# EasyEDA Pro project ACS DIN Controller.eprj, board Top Board
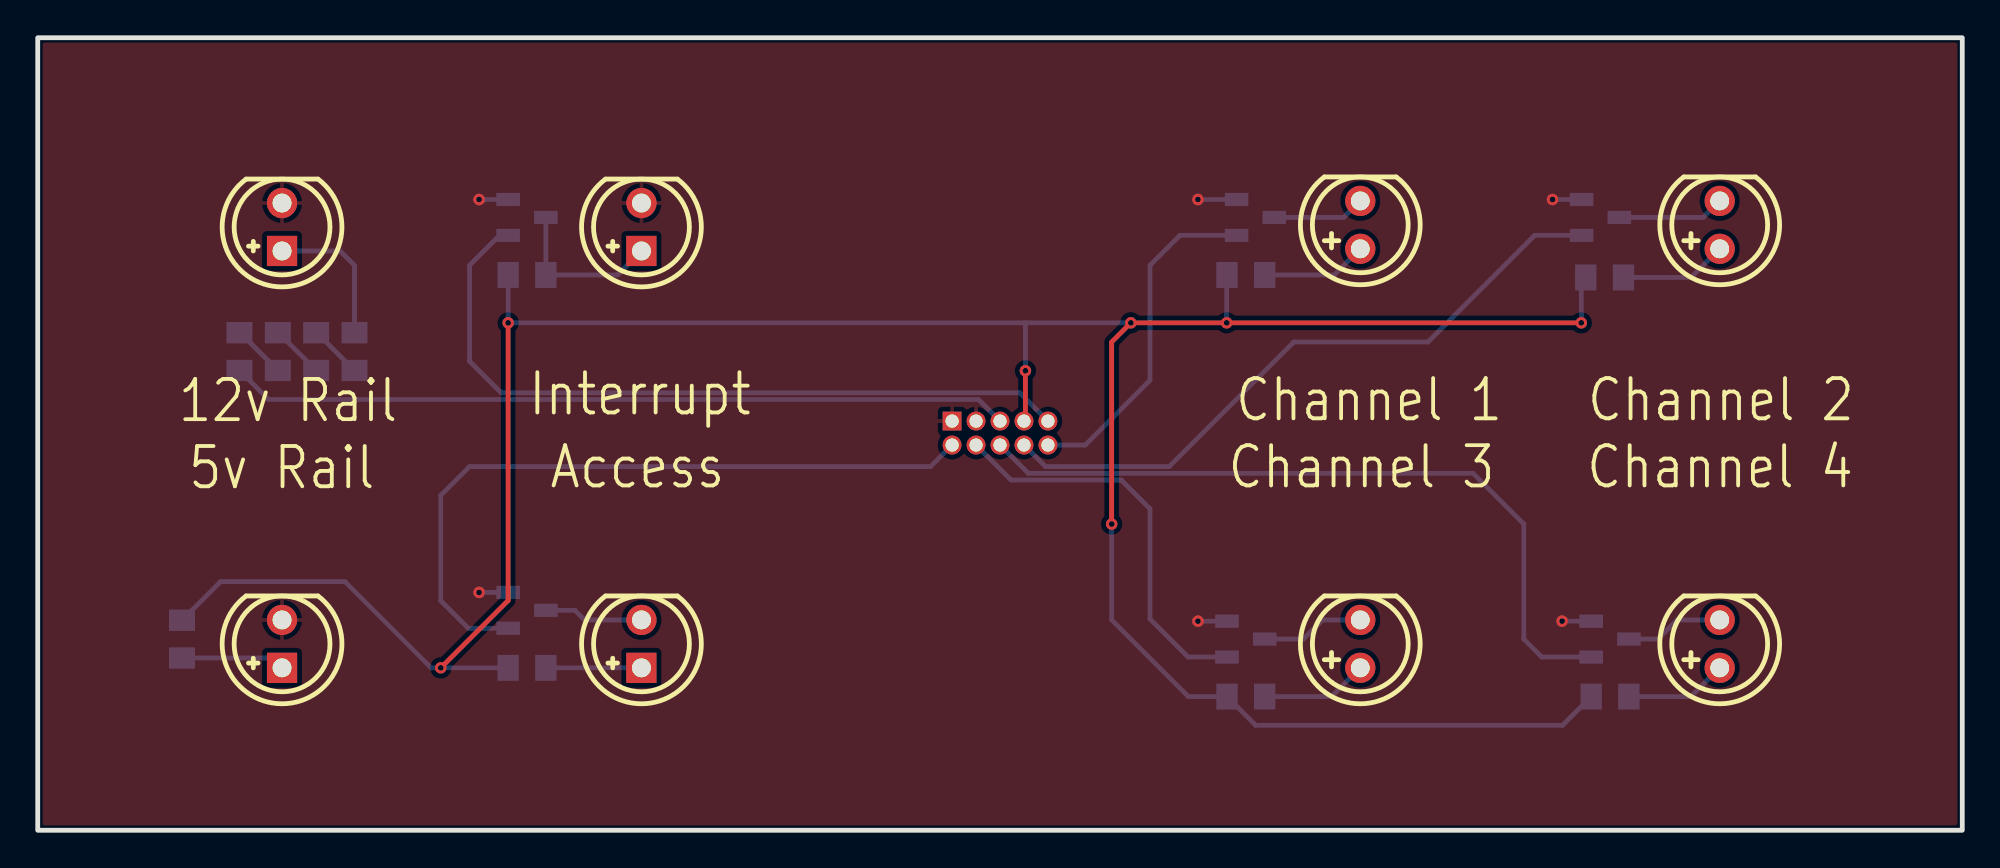
[diagram p4: board, top side]
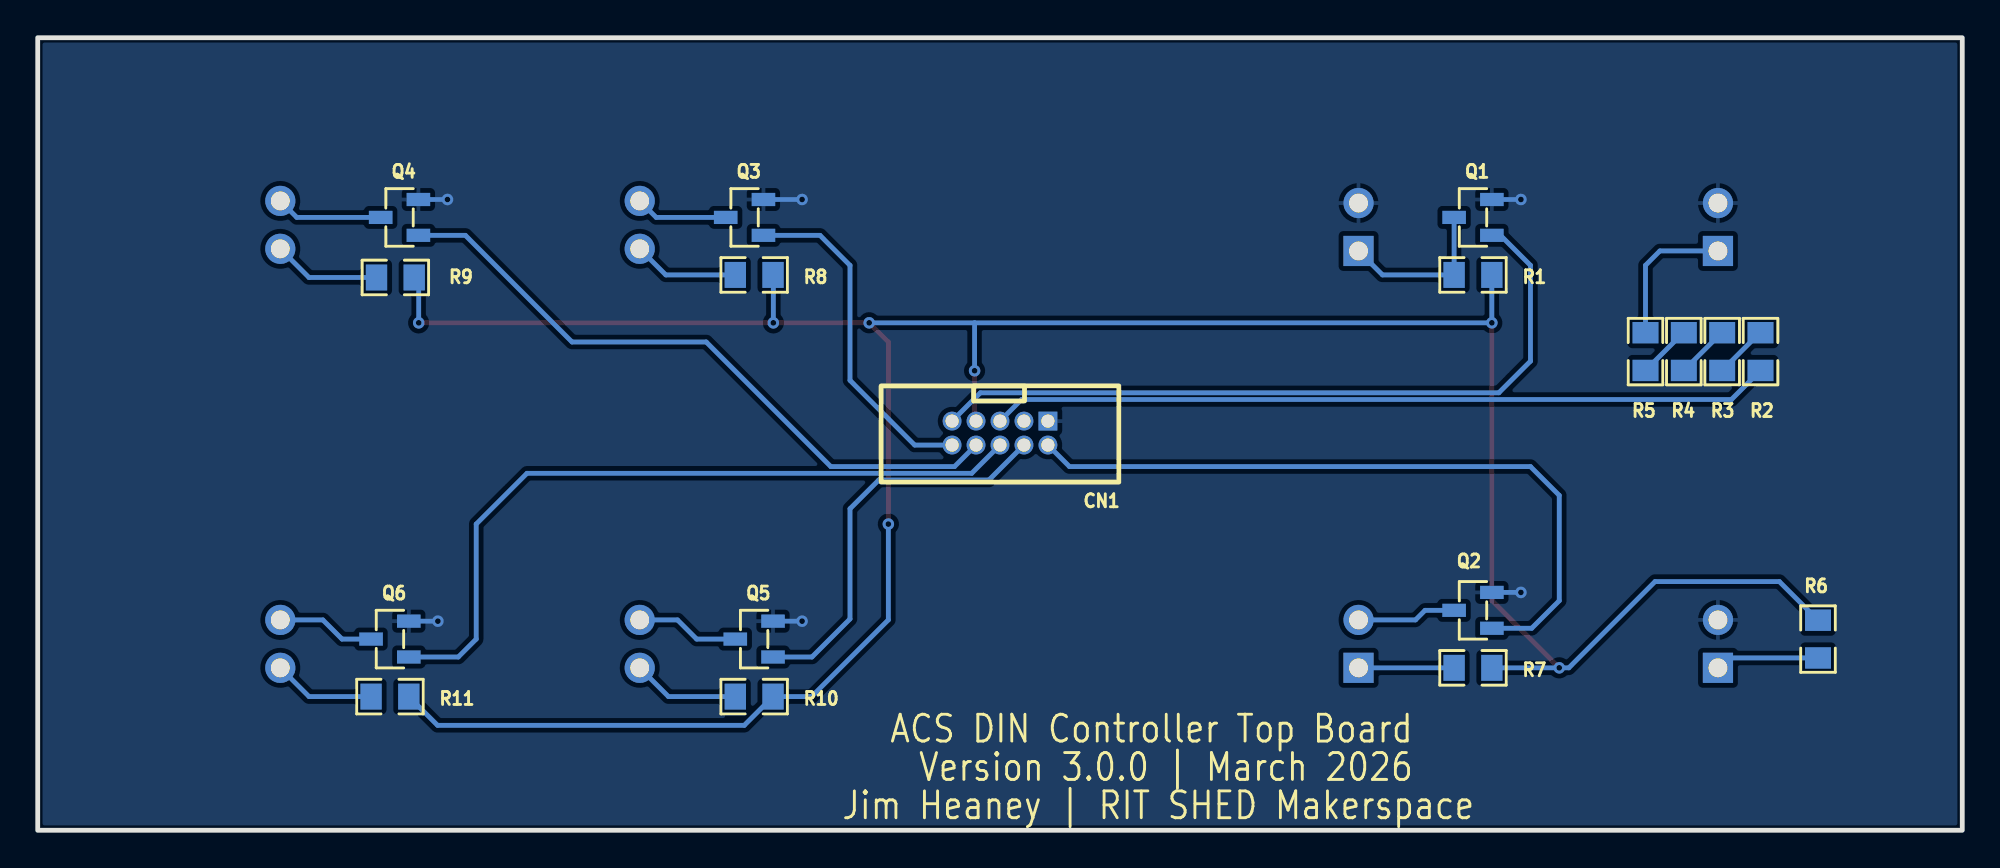
[diagram p5: board, bottom side, seen from below]

Outline 102.01 x 42.01 mm; copper layers: Top Layer, Bottom Layer. Coordinates in mm from the lower left corner of the outline.
Outline path: rectangle 0,0 102.01,42.01
Stack: Top Layer 0.035mm / Dielectric1 1.51mm FR4 er 4.5 / Bottom Layer 0.035mm

## Design rules (mm)
template: JLCPCB Capability(Two Layers Board)
spacing copperThickness1oz (default): track to track 0.102, other pairs 0.152 to 0.3
spacing copperThickness2oz: track to track 0.203, other pairs 0.152 to 0.3
track width copperThickness1oz (default): min 0.127, default 0.254, max 2.54
track width copperThickness2oz: min 0.203, default 0.254, max 2.54
differential pair differentialPair (default): width min 0.127, default 0.254, max 2.54; gap min 0.152, default 0.152
via viaSize (default): diameter min 0.5, default 0.61, max 10; hole min 0.3, default 0.305, max 6.3

## Placement (name value [footprint] x y rotation side)
CN1  X1270WV-2x05B-9TV01  [IDC-TH_10P-P1.27-X1270WV-2X05A-6TV01]  51 21.06 0 bottom
LED1  TJ-L5FYTGCRTFCSFLC2R-A5  [LED-TH_BD5.8-P2.54-FD]  32 31.98 90 top
LED2  TJ-L5FYTYGTDLSFLC6TW-A5  [LED-TH_BD5.8-P2.54-FD]  12.95 31.98 90 top
LED3  TJ-L5FYTYGTDLSFLC6TW-A5  [LED-TH_BD5.8-P2.54-FD]  12.95 9.88 90 top
LED4  TJ-L5FYTGHTCGSFLC9Y-A5  [LED-TH_BD5.8-P2.54-FD]  32 9.88 90 top
LED5  TJ-L5FYTGCTCGLFLC2G-A5  [LED-TH_BD5.0-P2.54-FD]  70.1 32.09 90 top
LED6  TJ-L5FYTGCTCGLFLC2G-A5  [LED-TH_BD5.0-P2.54-FD]  89.15 32.09 90 top
LED7  TJ-L5FYTGCTCGLFLC2G-A5  [LED-TH_BD5.0-P2.54-FD]  70.1 9.88 90 top
LED8  TJ-L5FYTGCTCGLFLC2G-A5  [LED-TH_BD5.0-P2.54-FD]  89.15 9.88 90 top
Q1  HL3400A  [SOT-23-3_L2.9-W1.3-P1.90-LS2.4-BR]  25.93 32.49 180 bottom
Q2  HL3400A  [SOT-23-3_L2.9-W1.3-P1.90-LS2.4-BR]  25.93 11.66 180 bottom
Q3  HL3400A  [SOT-23-3_L2.9-W1.3-P1.90-LS2.4-BR]  64.54 32.49 180 bottom
Q4  HL3400A  [SOT-23-3_L2.9-W1.3-P1.90-LS2.4-BR]  82.83 32.49 180 bottom
Q5  HL3400A  [SOT-23-3_L2.9-W1.3-P1.90-LS2.4-BR]  64.03 10.13 180 bottom
Q6  HL3400A  [SOT-23-3_L2.9-W1.3-P1.90-LS2.4-BR]  83.34 10.13 180 bottom
R1  1kΩ  [R0805]  25.93 29.44 180 bottom
R2  1kΩ  [R0805]  10.69 25.37 270 bottom
R3  1kΩ  [R0805]  12.73 25.37 270 bottom
R4  1kΩ  [R0805]  14.76 25.37 270 bottom
R5  1kΩ  [R0805]  16.79 25.37 270 bottom
R6  1kΩ  [R0805]  7.65 10.13 90 bottom
R7  1kΩ  [R0805]  25.93 8.61 180 bottom
R8  1kΩ  [R0805]  64.03 29.44 180 bottom
R9  1kΩ  [R0805]  83.05 29.3 180 bottom
R10  1kΩ  [R0805]  64.03 7.09 180 bottom
R11  1kΩ  [R0805]  83.34 7.09 180 bottom

## Footprints (pads in the part's own frame, mm; a bottom-side part is the same pattern mirrored in y, then rotated)
IDC-TH_10P-P1.27-X1270WV-2X05A-6TV01
  rect 1x1 hole 0.7: 1(-2.54,-0.635)
  round 1 hole 0.7: 2(-2.54,0.635) 3(-1.27,-0.635) 4(-1.27,0.635) 5(0,-0.635) 6(0,0.635) 7(1.27,-0.635) 8(1.27,0.635) 9(2.54,-0.635) 10(2.54,0.635)
LED-TH_BD5.0-P2.54-FD
  round 1.6 hole 1: 1(-1.27,0) 2(1.27,0)
LED-TH_BD5.8-P2.54-FD
  rect 1.6x1.6 hole 1: 1(-1.27,0)
  round 1.6 hole 1: 2(1.27,0)
R0805
  rect 1.133x1.377 smd: 1(-1,0) 2(1,0)
SOT-23-3_L2.9-W1.3-P1.90-LS2.4-BR
  rect 1.25x0.7 smd: 1(1,-0.95) 2(1,0.95) 3(-1,0)

## Nets
As in the schematic.

## Via types
v1: diameter 0.61, hole 0.305, Top Layer to Bottom Layer, 13 vias

## Routing (per net, layer and track width the routed paths; a pad name or vN(x,y) marks a point on that pad's centre or on a via; arc(x,y) is an arc through that point)
+5V: length 154
  Top Layer w0.254: CN1.7 52.35,21.77 v1(52.35,24.36) ; v1(81.81,26.9) v1(63.02,26.9) v1(57.94,26.9) 56.92,25.88 v1(56.92,16.23) ; v1(21.36,8.61) 24.93,12.18 v1(24.93,26.9)
  Bottom Layer w0.254: R9.2 81.81,29.07 v1(81.81,26.9) ; R7.2 v1(21.36,8.61) 20.85,8.61 16.28,13.18 9.69,13.18 R6.2 ; v1(56.92,16.23) 56.92,11.15 60.99,7.09 R10.2 64.56,5.56 80.81,5.56 R11.2 ; 52.35,26.9 v1(57.94,26.9) ; 52.35,26.9 v1(24.93,26.9) R1.2 ; 52.35,26.9 v1(52.35,24.36) ; v1(63.02,26.9) 63.02,29.42 R8.2
+12V: length 41.4
  Bottom Layer w0.254: CN1.5 49.86,22.83 12.23,22.83 R2.2
GND: length 9.7
  Bottom Layer w0.254: Q6.2 v1(80.8,11.08) ; Q5.2 v1(61.49,11.08) ; Q2.2 v1(23.39,12.61) ; Q3.2 v1(61.49,33.44) ; Q4.2 v1(80.29,33.44) ; Q1.2 v1(23.39,33.44)
ACCESS: length 38
  Bottom Layer w0.254: Q2.1 22.82,10.71 21.36,12.17 21.36,17.75 22.89,19.28 47.32,19.28 CN1.2
GPIO1: length 18.2
  Bottom Layer w0.254: Q3.1 60.54,31.54 58.95,29.95 58.95,23.85 55.52,20.42 CN1.10
GPIO2: length 35.1
  Bottom Layer w0.254: CN1.8 53.42,19.28 59.97,19.28 66.57,25.88 73.69,25.88 79.34,31.54 Q4.1
GPIO3: length 21.4
  Bottom Layer w0.254: CN1.4 51.59,18.57 57.43,18.57 58.95,17.04 58.95,11.2 60.97,9.18 Q5.1
GPIO4: length 39.6
  Bottom Layer w0.254: CN1.6 52.5,18.92 76.07,18.92 78.77,16.23 78.77,10.13 79.72,9.18 Q6.1
INTERRUPT: length 39.8
  Bottom Layer w0.254: CN1.9 52.04,23.19 24.56,23.19 22.89,24.87 22.89,29.95 24.48,31.54 Q1.1
$1N995: length 8.1
  Bottom Layer w0.254: Q1.3 R1.1 ; 27.46,29.44 30.73,29.44 LED1.1
$1N1232: length 5.5
  Bottom Layer w0.254: LED3.1 12.43,9.13 R6.1
$1N1271: length 7.7
  Bottom Layer w0.254: LED2.1 16.03,30.71 16.79,29.95 R5.1
$1N1349: length 2.9
  Bottom Layer w0.254: R5.2 14.79,26.37 R4.1
$1N1388: length 2.9
  Bottom Layer w0.254: R3.1 12.76,26.37 R4.2
$1N1427: length 2.9
  Bottom Layer w0.254: R2.1 10.73,26.37 R3.2
$1N1573: length 5.1
  Bottom Layer w0.254: R7.1 LED4.1
$1N1719: length 5.3
  Bottom Layer w0.254: LED4.2 28.98,11.15 28.47,11.66 Q2.3
$1N1899: length 5.6
  Bottom Layer w0.254: R8.1 68.72,29.44 LED5.1
$1N1901: length 4.9
  Bottom Layer w0.254: LED5.2 69.22,32.49 Q3.3
$1N2053: length 5.7
  Bottom Layer w0.254: Q4.3 88.27,32.49 LED6.2
$1N2055: length 5.7
  Bottom Layer w0.254: LED6.1 87.63,29.3 R9.1
$1N2211: length 5.5
  Bottom Layer w0.254: LED7.2 68.1,11.15 67.08,10.13 Q5.3
$1N2213: length 5.7
  Bottom Layer w0.254: LED7.1 68.58,7.09 R10.1
$1N2369: length 5.2
  Bottom Layer w0.254: Q6.3 85.88,10.13 86.89,11.15 LED8.2
$1N2371: length 5.4
  Bottom Layer w0.254: R11.1 87.63,7.09 LED8.1

## Copper pours and planes (outline as drawn; the poured copper is in the pictures)
GND on Top Layer: -3.53,44.68 105.18,44.68 105.18,-3.58 -3.53,-3.58
GND on Bottom Layer: -2.51,44.17 104.67,44.17 104.67,-2.57 -2.51,-2.57

## Text on the board
Bottom Silkscreen Layer: Version 3.0.0 | March 2026 | ACS DIN Controller Top Board | Jim Heaney | RIT SHED Makerspace
Top Silkscreen Layer: 12v Rail | 5v Rail | Interrupt | Access | Channel 3 | Channel 1 | Channel 4 | Channel 2
